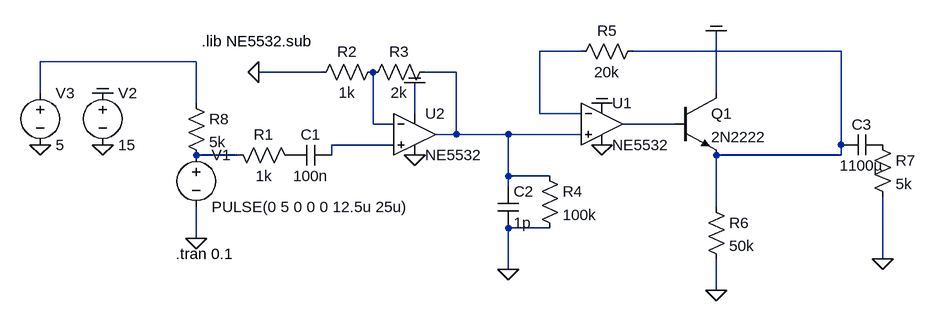
[diagram p0: schematic SignalConditioning.asc]
SignalConditioning.asc, the LTspice schematic file:
Version 4
SHEET 1 1380 1152
WIRE 608 0 544 0
WIRE 1008 0 688 0
WIRE 16 16 -224 16
WIRE 208 32 112 32
WIRE 416 32 368 32
WIRE -224 64 -224 16
WIRE 816 64 816 -32
WIRE 16 80 16 16
WIRE 352 96 352 48
WIRE 544 96 544 0
WIRE 608 96 544 96
WIRE 288 112 288 32
WIRE 320 112 288 112
WIRE 752 112 672 112
WIRE 416 128 416 32
WIRE 416 128 384 128
WIRE 496 128 416 128
WIRE 608 128 496 128
WIRE 320 144 224 144
WIRE 1008 144 1008 0
WIRE 80 160 16 160
WIRE 224 160 224 144
WIRE 1008 160 1008 144
WIRE 1008 160 816 160
WIRE 496 192 496 128
WIRE 560 192 496 192
WIRE 496 208 496 192
WIRE 816 240 816 160
WIRE 560 272 496 272
WIRE 16 288 16 240
WIRE 1072 320 1072 224
WIRE 496 336 496 272
WIRE 816 368 816 320
FLAG 16 288 0
FLAG -128 144 0
FLAG -128 64 COM
FLAG 352 160 0
FLAG 352 48 COM
FLAG 816 -32 COM
FLAG 112 32 0
FLAG 640 144 0
FLAG 496 336 0
FLAG 816 368 0
FLAG 1072 320 0
FLAG 640 80 COM
FLAG -224 144 0
SYMBOL voltage 16 144 R0
WINDOW 123 0 0 Left 0
WINDOW 39 0 0 Left 0
SYMATTR InstName V1
SYMATTR Value PULSE(0 5 0 0 0 12.5u 25u)
SYMBOL voltage -128 48 R0
WINDOW 123 0 0 Left 0
WINDOW 39 0 0 Left 0
SYMATTR InstName V2
SYMATTR Value 15
SYMBOL Opamps\\opamp2 352 64 R0
SYMATTR InstName U2
SYMATTR Value NE5532
SYMBOL npn 752 64 R0
SYMATTR InstName Q1
SYMATTR Value 2N2222
SYMBOL res 64 144 M90
WINDOW 0 0 56 VBottom 2
WINDOW 3 32 56 VTop 2
SYMATTR InstName R1
SYMATTR Value 1k
SYMBOL cap 224 144 R90
WINDOW 0 0 32 VBottom 2
WINDOW 3 32 32 VTop 2
SYMATTR InstName C1
SYMATTR Value 100n
SYMBOL res 304 16 R90
WINDOW 0 0 56 VBottom 2
WINDOW 3 32 56 VTop 2
SYMATTR InstName R2
SYMATTR Value 1k
SYMBOL res 384 16 R90
WINDOW 0 0 56 VBottom 2
WINDOW 3 32 56 VTop 2
SYMATTR InstName R3
SYMATTR Value 2k
SYMBOL Opamps\\opamp2 640 48 R0
SYMATTR InstName U1
SYMATTR Value NE5532
SYMBOL cap 480 208 R0
SYMATTR InstName C2
SYMATTR Value 1p
SYMBOL res 544 176 R0
SYMATTR InstName R4
SYMATTR Value 100k
SYMBOL res 704 -16 R90
WINDOW 0 0 56 VBottom 2
WINDOW 3 32 56 VTop 2
SYMATTR InstName R5
SYMATTR Value 20k
SYMBOL res 800 224 R0
SYMATTR InstName R6
SYMATTR Value 50k
SYMBOL cap 1072 128 R90
WINDOW 0 0 32 VBottom 2
WINDOW 3 32 32 VTop 2
SYMATTR InstName C3
SYMATTR Value 1100µ
SYMBOL res 1056 128 R0
SYMATTR InstName R7
SYMATTR Value 5k
SYMBOL res 0 64 R0
SYMATTR InstName R8
SYMATTR Value 5k
SYMBOL voltage -224 48 R0
WINDOW 123 0 0 Left 0
WINDOW 39 0 0 Left 0
SYMATTR InstName V3
SYMATTR Value 5
TEXT 24 -16 Left 2 !.lib NE5532.sub
TEXT -16 312 Left 2 !.tran 0.1

The netlist it stands for:
* SignalConditioning.asc
V1 N008 0 PULSE(0 5 0 0 0 12.5u 25u)
V2 COM 0 15
XU2 N007 N005 COM 0 N004 NE5532  ; pins In+ In- V+ V- OUT
Q1 COM N006 N002 0 2N2222
R1 N008 P001 1k
C1 N007 P001 100n
R2 N005 0 1k
R3 N004 N005 2k
XU1 N004 N001 COM 0 N006 NE5532  ; pins In+ In- V+ V- OUT
C2 N004 0 1p
R4 N004 0 100k
R5 N002 N001 20k
R6 N002 0 50k
C3 P002 N002 1100µ
R7 P002 0 5k
R8 N003 N008 5k
V3 N003 0 5
.model NPN NPN
.model PNP PNP
.lib standard.bjt
.lib NE5532.sub
.tran 0.1
.backanno
.end